# EAGLE design transistor_logic (EAGLE 8.6.3)
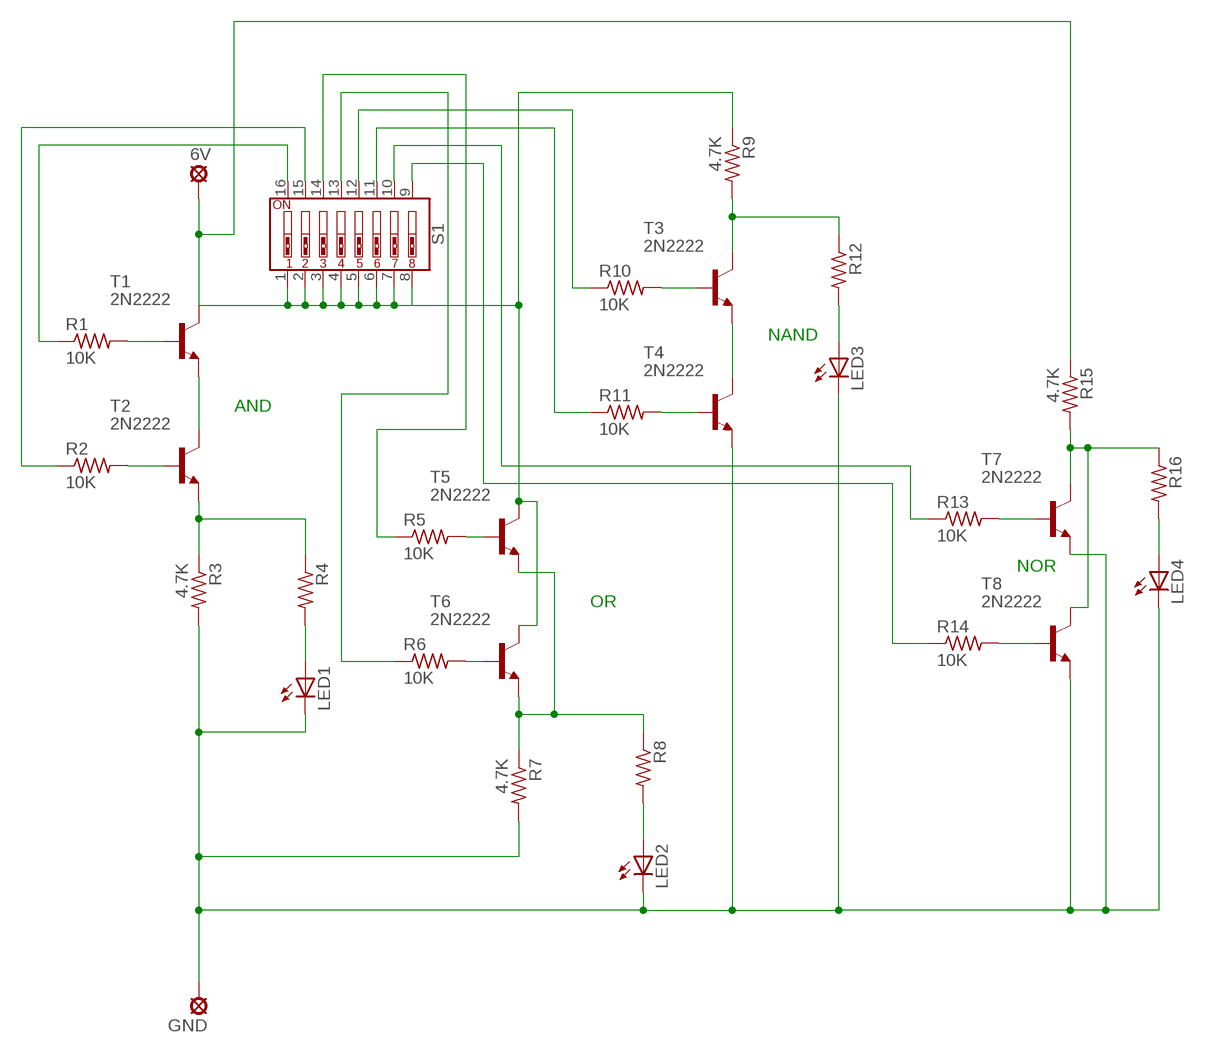
[diagram p0: schematic, sheet 1]

## Parts
6V  6V  LSP07  [LSP07]
GND  GND  LSP07  [LSP07]
LED1  LED5MM  [LED5MM]
LED2  LED5MM  [LED5MM]
LED3  LED5MM  [LED5MM]
LED4  LED5MM  [LED5MM]
R1  10K  R-US_0207/9  [0207/9]
R2  10K  R-US_0207/9  [0207/9]
R3  4.7K  R-US_0207/9  [0207/9]
R4  R-US_0207/9  [0207/9]
R5  10K  R-US_0207/9  [0207/9]
R6  10K  R-US_0207/9  [0207/9]
R7  4.7K  R-US_0207/9  [0207/9]
R8  R-US_0207/9  [0207/9]
R9  4.7K  R-US_0207/9  [0207/9]
R10  10K  R-US_0207/9  [0207/9]
R11  10K  R-US_0207/9  [0207/9]
R12  R-US_0207/9  [0207/9]
R13  10K  R-US_0207/9  [0207/9]
R14  10K  R-US_0207/9  [0207/9]
R15  4.7K  R-US_0207/9  [0207/9]
R16  R-US_0207/9  [0207/9]
S1  DIP-08-PTH  [DIPSWITCH-08]
T1  2N2222  [TO92-EBC-OVAL]
T2  2N2222  [TO92-EBC-OVAL]
T3  2N2222  [TO92-EBC-OVAL]
T4  2N2222  [TO92-EBC-OVAL]
T5  2N2222  [TO92-EBC-OVAL]
T6  2N2222  [TO92-EBC-OVAL]
T7  2N2222  [TO92-EBC-OVAL]
T8  2N2222  [TO92-EBC-OVAL]

## Nets
N$1: R1.2 T1.B
N$2: T1.E T2.C
N$3: R2.2 T2.B
N$4: R3.1 R4.1 T2.E
N$5: LED1.A R4.2
N$6: 6V.P$1(MP) R9.1 R15.1 S1.1 S1.2 S1.3 S1.4 S1.5 S1.6 S1.7 S1.8 T1.C T5.C T6.C
N$7: GND.P$1(MP) LED1.K(C) LED2.K(C) LED3.K(C) LED4.K(C) R3.2 R7.2 T4.E T7.E T8.E
N$8: R1.1 S1.16
N$9: R2.1 S1.15
N$10: R5.2 T5.B
N$11: R6.2 T6.B
N$12: R7.1 R8.1 T5.E T6.E
N$14: LED2.A R8.2
N$16: R5.1 S1.14
N$17: R6.1 S1.13
N$18: R9.2 R12.1 T3.C
N$19: T3.E T4.C
N$20: R10.2 T3.B
N$21: R11.2 T4.B
N$22: LED3.A R12.2
N$23: R10.1 S1.12
N$24: R11.1 S1.11
N$25: R13.2 T7.B
N$26: R14.2 T8.B
N$27: R15.2 R16.1 T7.C T8.C
N$29: LED4.A R16.2
N$30: R13.1 S1.10
N$31: R14.1 S1.9

## Notes on the sheet
- NAND
- AND
- NOR
- OR

## Library data of the parts
6V GND = solpad:LSP07: Custom 0.7mm Solder Pad Solder pad. 0.7mm drill width and 1.46mm total diameter (1.00mm pad).
LED1-LED4 = adafruit:LED: LED OSRAM: - CHIPLED LG R971, LG N971, LY N971, LG Q971, LY Q971, LO R971, LY R971 LH N974, LH R974 LS Q976, LO Q976, LY Q976 LO Q996 - Hyper CHIPLED LW Q18S LB Q993, LB Q99A, LB R99A - SideLED LS A670, LO A670, LY A670, LG A670, LP A670 LB A673, LV A673, LT A673, LW A673 LH A674 LY A675 LS A676, LA A676, LO A676, LY A676, LW A676 LS A679, LY A679, LG A679 - Hyper Micro SIDELED® LS Y876, LA Y876, LO Y876, LY Y876 LT Y87S - SmartLED LW L88C, LW L88S LB L89C, LB L89S, LG L890 LS L89K, LO L89K, LY L89K LS L896, LA L896, LO L896, LY L896 - TOPLED LS T670, LO T670, LY T670, LG T670, LP T670 LSG T670, LSP T670, LSY T670, LOP T670, LYG T670 LG T671, LOG T671, LSG T671 LB T673, LV T673, LT T673, LW T673 LH T674 LS T676, LA T676, LO T676, LY T676, LB T676, LH T676, LSB T676, LW T676 LB T67C, LV T67C, LT T67C, LS T67K, LO T67K, LY T67K, LW E67C LS E67B, LA E67B, LO E67B, LY E67B, LB E67C, LV E67C, LT E67C LW T67C LS T679, LY T679, LG T679 LS T770, LO T770, LY T770, LG T770, LP T770 LB T773, LV T773, LT T773, LW T773 LH T774 LS E675, LA E675, LY E675, LS T675 LS T776, LA T776, LO T776, LY T776, LB T776 LHGB T686 LT T68C, LB T68C - Hyper Mini TOPLED® LB M676 - Mini TOPLED Santana® LG M470 LS M47K, LO M47K, LY M47K Source: http://www.osram.convergy.de/
R1-R16 = adafruit:R-US_: RESISTOR, American symbol
S1 = SparkFun-Switches:DIP-08: 8-Position DIP Switch 8-circuit DIP (dual inline package) switch. Commonly used to physcially set a circuit's behavior. SparkFun Products DIP Switch - 8 Position <https://www.sparkfun.com/products/8034> (COM-08034); PROD_ID: SWCH-12197; SF_SKU: COM-08034
T1-T8 = adafruit:2N2222: NPN TRANSISTOR Big oval pads

## Board
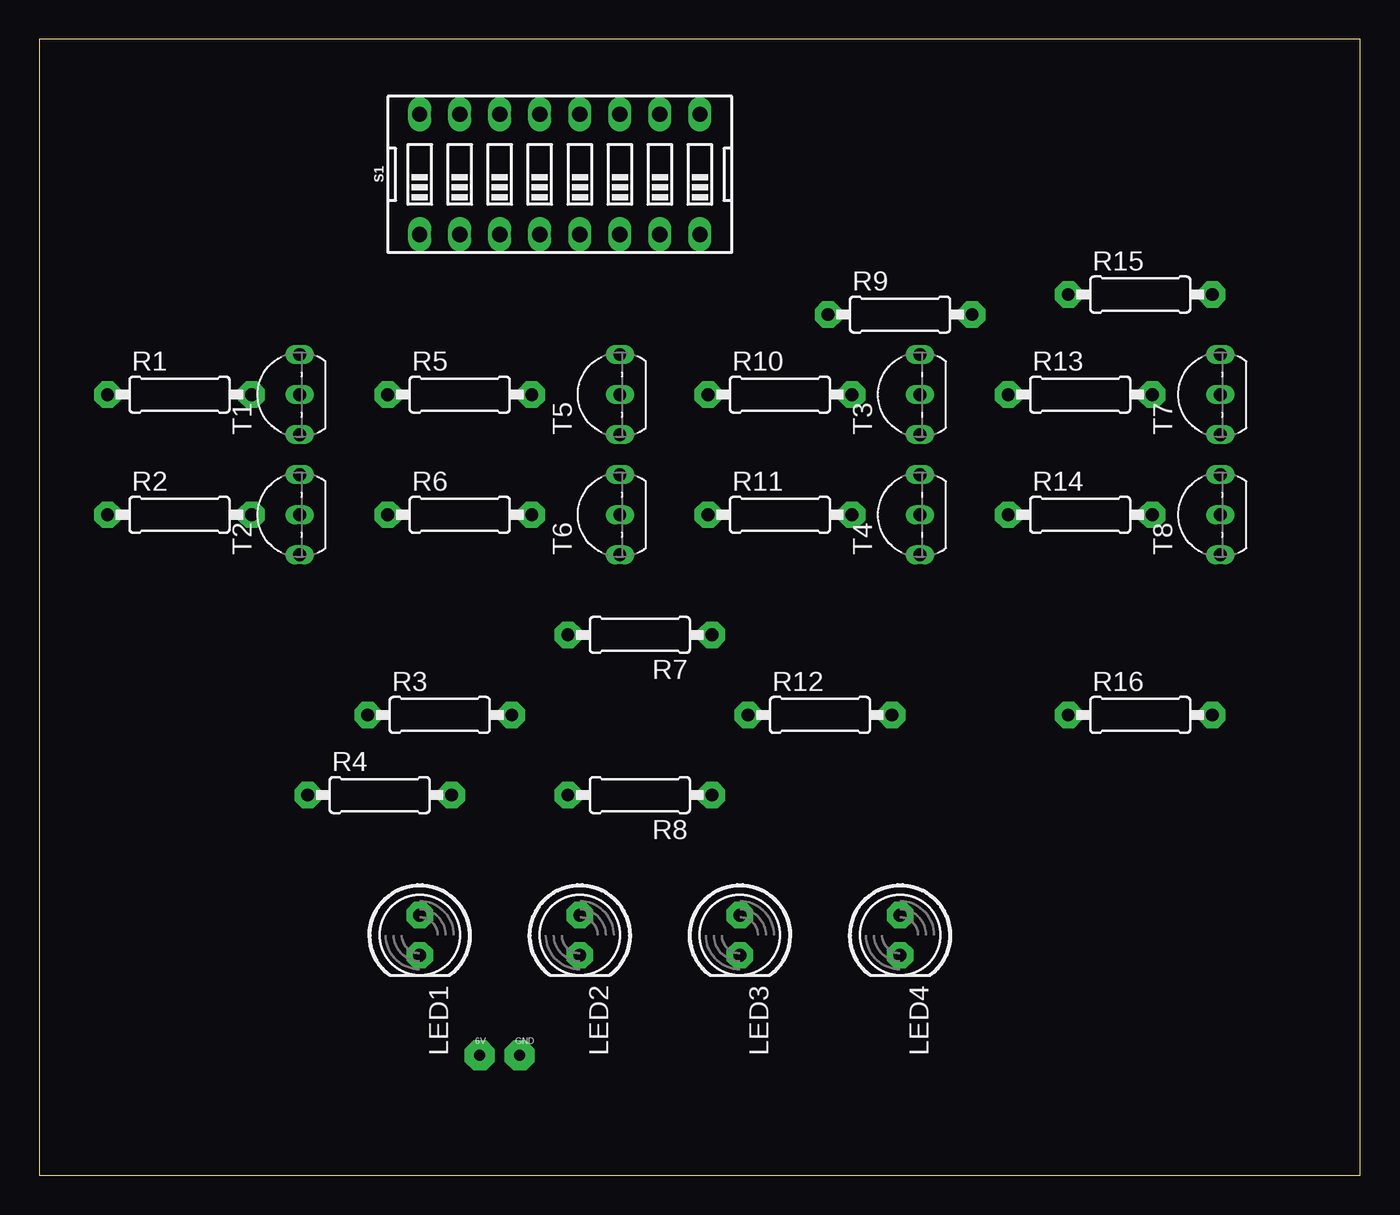
[diagram p1: board, top side]
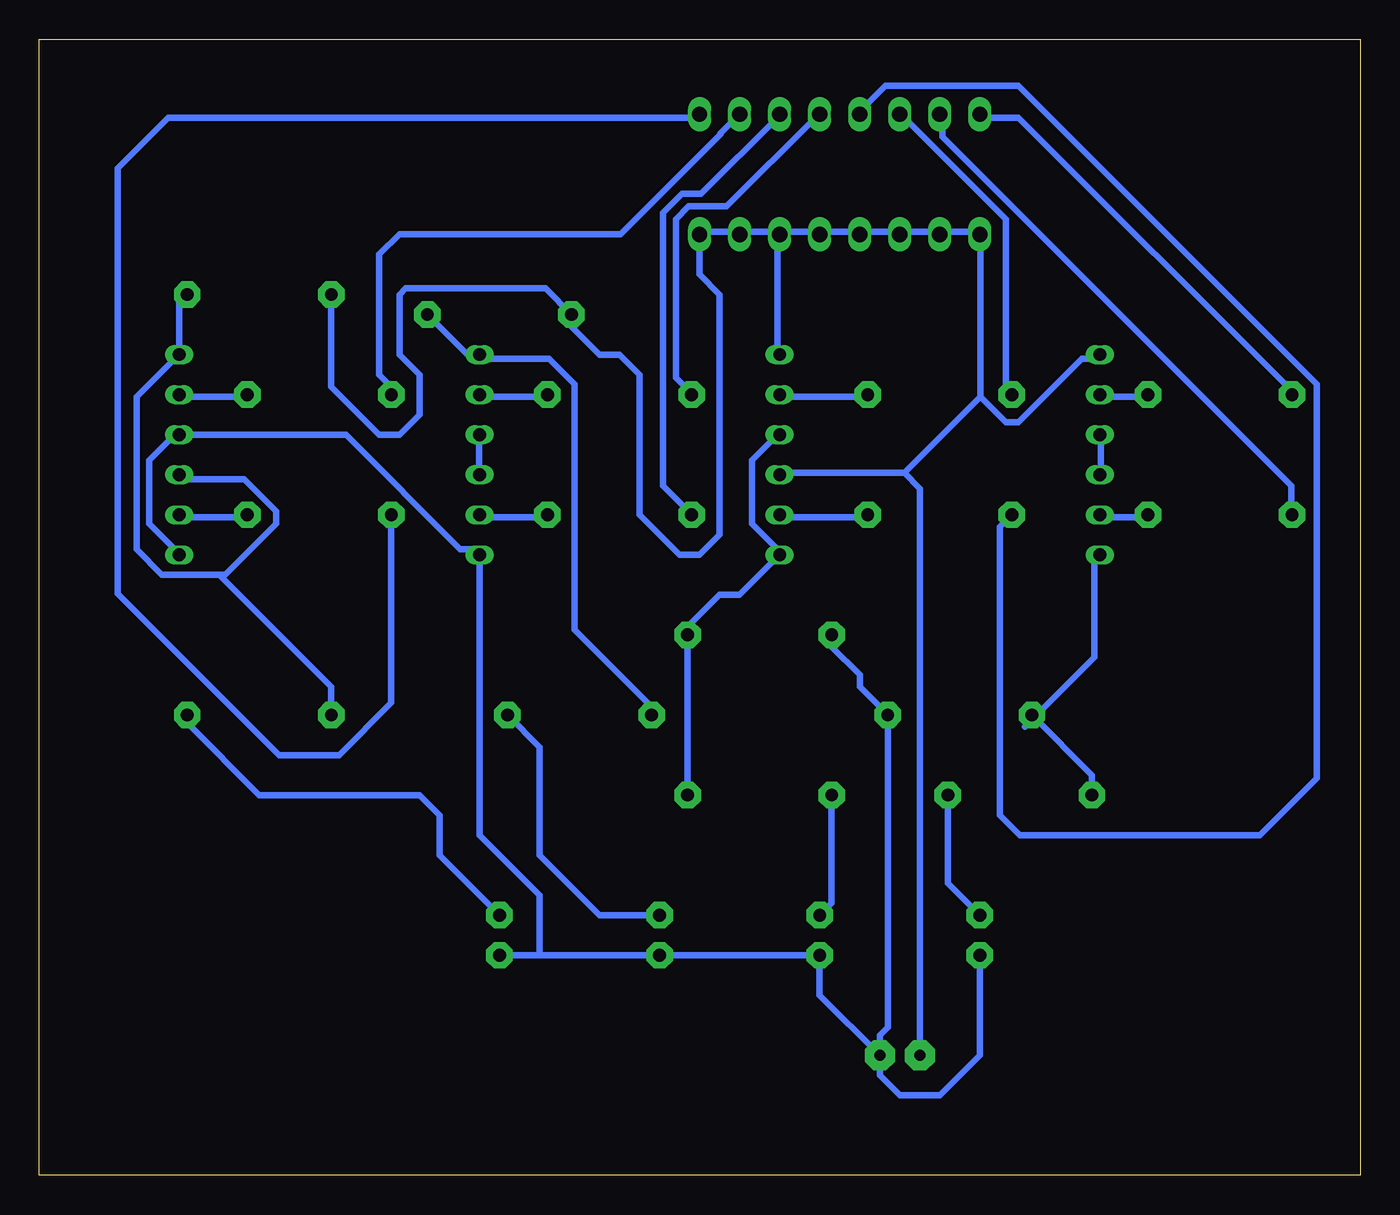
[diagram p2: board, bottom side, seen from below]

Size 83.8 x 72.06 mm. Coordinates in mm from the lower left corner, seen from the top.
Outline: 0,0 83.8,0 83.8,72.06 0,72.06 0,0
Copper layers (1*16): Top 0.035mm / dielectric 1.5mm / Bottom 0.035mm
Design rules "OthermillDRC_1_64_v2": minimum track width 16mil, minimum drill 31mil, track to track 0.39878125mm, track to pad 0.39878125mm, pad to pad 0.39878125mm, via to via 0.39878125mm, smd to smd 0mil, copper to edge 0mil, drill to drill 1mil, minimum pad ring 0mil, minimum via ring 15mil, stop-mask expansion 1mil, vias tented up to drill 30mil, thermal gap 10mil

### Footprints (pad centres in the part's own frame; a part is rotated, then mirrored left to right if it is on the bottom)
LSP07 = drill 0.7 pad 1.905 octagon: P$1 0,0
LED5MM = drill 0.813 pad 1.676 octagon: A -1.27,0; K 1.27,0
0207/9 = drill 0.813 pad 1.676 octagon: 1 -4.572,0; 2 4.572,0
DIPSWITCH-08 = drill 0.97 long: 1 -8.89,-3.81; 2 -6.35,-3.81; 3 -3.81,-3.81; 4 -1.27,-3.81; 5 1.27,-3.81; 6 3.81,-3.81; 7 6.35,-3.81; 8 8.89,-3.81; 9 8.89,3.81; 10 6.35,3.81; 11 3.81,3.81; 12 1.27,3.81; 13 -1.27,3.81; 14 -3.81,3.81; 15 -6.35,3.81; 16 -8.89,3.81
TO92-EBC-OVAL = drill 0.813 long: B 0,-1.27; C 2.54,-1.27; E -2.54,-1.27

### Placement (x,y rotation side)
6V  27.94,7.62 0 top
GND  30.48,7.62 0 top
LED1  24.13,15.24 270 top
LED2  34.29,15.24 270 top
LED3  44.45,15.24 270 top
LED4  54.61,15.24 270 top
R1  8.89,49.53 0 top
R2  8.89,41.91 0 top
R3  25.4,29.21 0 top
R4  21.59,24.13 0 top
R5  26.67,49.53 0 top
R6  26.67,41.91 0 top
R7  38.1,34.29 180 top
R8  38.1,24.13 180 top
R9  54.61,54.61 0 top
R10  46.99,49.53 0 top
R11  46.99,41.91 0 top
R12  49.53,29.21 0 top
R13  66.04,49.53 0 top
R14  66.04,41.91 0 top
R15  69.85,55.88 0 top
R16  69.85,29.21 0 top
S1  33.02,63.5 0 top
T1  15.24,49.53 90 top
T2  15.24,41.91 90 top
T3  54.61,49.53 90 top
T4  54.61,41.91 90 top
T5  35.56,49.53 90 top
T6  35.56,41.91 90 top
T7  73.66,49.53 90 top
T8  73.66,41.91 90 top

### Tracks (layer width: path | path; a pad name or v marks a point on that pad's centre or on a via)
N$1
  Bottom 0.406: T1.B 16.44,49.39 13.63,49.39 R1.2
N$2
  Bottom 0.406: T2.C 16.44,44.56 16.44,46.98 T1.E
N$3
  Bottom 0.406: T2.B 16.44,41.74 13.63,41.74 R2.2
N$4
  Bottom 0.406: T2.E 16.85,39.33 16.85,32.88 20.47,29.26 R3.1 | 21.27,28.46 20.87,28.86 R3.1 | R3.1 17.02,25.4 R4.1
N$5
  Bottom 0.406: LED1.A 26.16,18.54 R4.2
N$6
  Bottom 0.406: T5.C 36.98,52.21 36.98,59.45 S1.6 | S1.6 36.98,59.86 38.99,59.86 S1.7 39.39,59.86 41.81,59.86 S1.8 41.91,57.15 40.64,55.88 40.64,40.64 41.91,39.37 43.18,39.37 45.72,41.91 45.72,50.8 46.99,52.07 48.26,52.07 50.04,53.85 R9.1 51.69,56.26 | S1.6 36.57,59.86 34.56,59.86 S1.5 34.16,59.86 32.15,59.86 S1.4 31.74,59.86 29.33,59.86 S1.3 28.92,59.86 26.91,59.86 S1.2 26.51,59.86 24.5,59.86 S1.1 24.09,59.45 24.09,49.39 | 24.09,49.39 22.48,47.78 21.68,47.78 17.65,51.81 16.85,51.81 T1.C | 28.92,44.56 36.57,44.56 T6.C | 24.09,49.39 28.92,44.56 | 6V.P$1 27.94,43.58 28.92,44.56 | 51.69,56.26 | 51.69,56.26 60.58,56.26 60.96,55.88 60.96,52.07 59.69,50.8 59.69,48.26 60.96,46.99 62.23,46.99 65.28,50.04 R15.1
N$7
  Bottom 0.406: T4.E 55.9,39.73 57.11,39.73 64.35,46.98 74.82,46.98 T7.E 75.22,46.98 76.83,45.36 76.83,41.34 75.22,39.73 T8.E | 30.13,28.86 R3.2 | 54.5,14.12 LED4.K 52.07,13.97 | 55.9,39.33 T4.E | 52.07,13.97 LED3.K LED2.K 34.29,11.43 GND.P$1 | R3.2 29.97,9.4 30.48,8.89 GND.P$1 | R3.2 31.75,30.99 31.75,31.75 33.53,33.53 R7.2 | GND.P$1 30.48,6.35 29.21,5.08 26.67,5.08 24.13,7.62 LED1.K | T4.E 55.88,21.59 52.07,17.78 52.07,13.97
N$8
  Bottom 0.406: S1.16 24.09,67.1 21.68,67.1 4.37,49.79 R1.1
N$9
  Bottom 0.406: S1.15 26.51,67.1 26.51,65.9 4.37,43.75 4.37,42.14 R2.1
N$10
  Bottom 0.406: T5.B 36.57,49.39 31.34,49.39 R5.2
N$11
  Bottom 0.406: T6.B 36.57,41.74 31.34,41.74 R6.2
N$12
  Bottom 0.406: 36.98,39.33 T6.E | T5.E 36.98,46.98 38.59,45.36 38.59,41.34 36.98,39.73 T6.E | T6.E 39.37,36.83 40.64,36.83 42.67,34.8 R7.1 R8.1
N$14
  Bottom 0.406: R8.2 33.53,17.27 LED2.A
N$16
  Bottom 0.406: S1.14 28.92,67.1 22.48,60.66 22.48,49.79 R5.1
N$17
  Bottom 0.406: S1.13 31.74,67.51 30.13,69.12 21.68,69.12 2.76,50.2 2.76,25.18 6.35,21.59 21.59,21.59 22.86,22.86 22.86,41.15 R6.1
N$18
  Bottom 0.406: R9.2 56.64,52.07 T3.C 55.49,51.81 51.47,51.81 49.86,50.2 49.86,34.62 44.96,29.72 R12.1
N$19
  Bottom 0.406: T4.C 55.9,44.56 55.9,46.98 T3.E
N$20
  Bottom 0.406: T3.B 55.49,49.39 51.87,49.39 R10.2
N$21
  Bottom 0.406: T4.B 55.49,41.74 51.87,41.74 R11.2
N$22
  Bottom 0.406: R12.2 52.07,27.18 52.07,20.32 48.26,16.51 LED3.A
N$23
  Bottom 0.406: S1.12 34.56,67.1 40.2,61.47 42.61,61.47 43.42,60.66 43.42,50.6 42.61,49.79 R10.1
N$24
  Bottom 0.406: S1.11 36.98,67.1 41.81,62.27 43.02,62.27 44.22,61.07 44.22,43.75 42.61,42.14 R11.1
N$25
  Bottom 0.406: T7.B 74.82,49.39 70.79,49.39 R13.2
N$26
  Bottom 0.406: T8.B 74.82,41.74 70.79,41.74 R14.2
N$27
  Bottom 0.406: 72.39,38.12 76.03,38.12 77.64,39.73 77.64,49.39 75.22,51.81 T7.C | 72.39,38.12 72,38.12 68.78,41.34 68.78,42.14 70.79,44.16 74.82,44.16 T8.C | 75.22,52.21 T7.C | R15.2 74.93,55.37 T7.C | R16.1 65.28,31.01 72.39,38.12
N$29
  Bottom 0.406: LED4.A 58.42,20.32 58.42,22.86 59.69,24.13 69.85,24.13 74.42,28.7 R16.2
N$30
  Bottom 0.406: R13.1 61.47,50.04 62.23,50.8 62.23,58.42 60.96,59.69 46.92,59.69 40.58,66.03 40.58,66.1 S1.10
N$31
  Bottom 0.406: S1.9 42.21,67.1 75.62,67.1 78.85,63.88 78.85,36.91 78.82,36.91 68.58,26.67 64.77,26.67 61.47,29.97 R14.1 61.13,41.74